# EAGLE design buck_regulator (EAGLE 6.2)
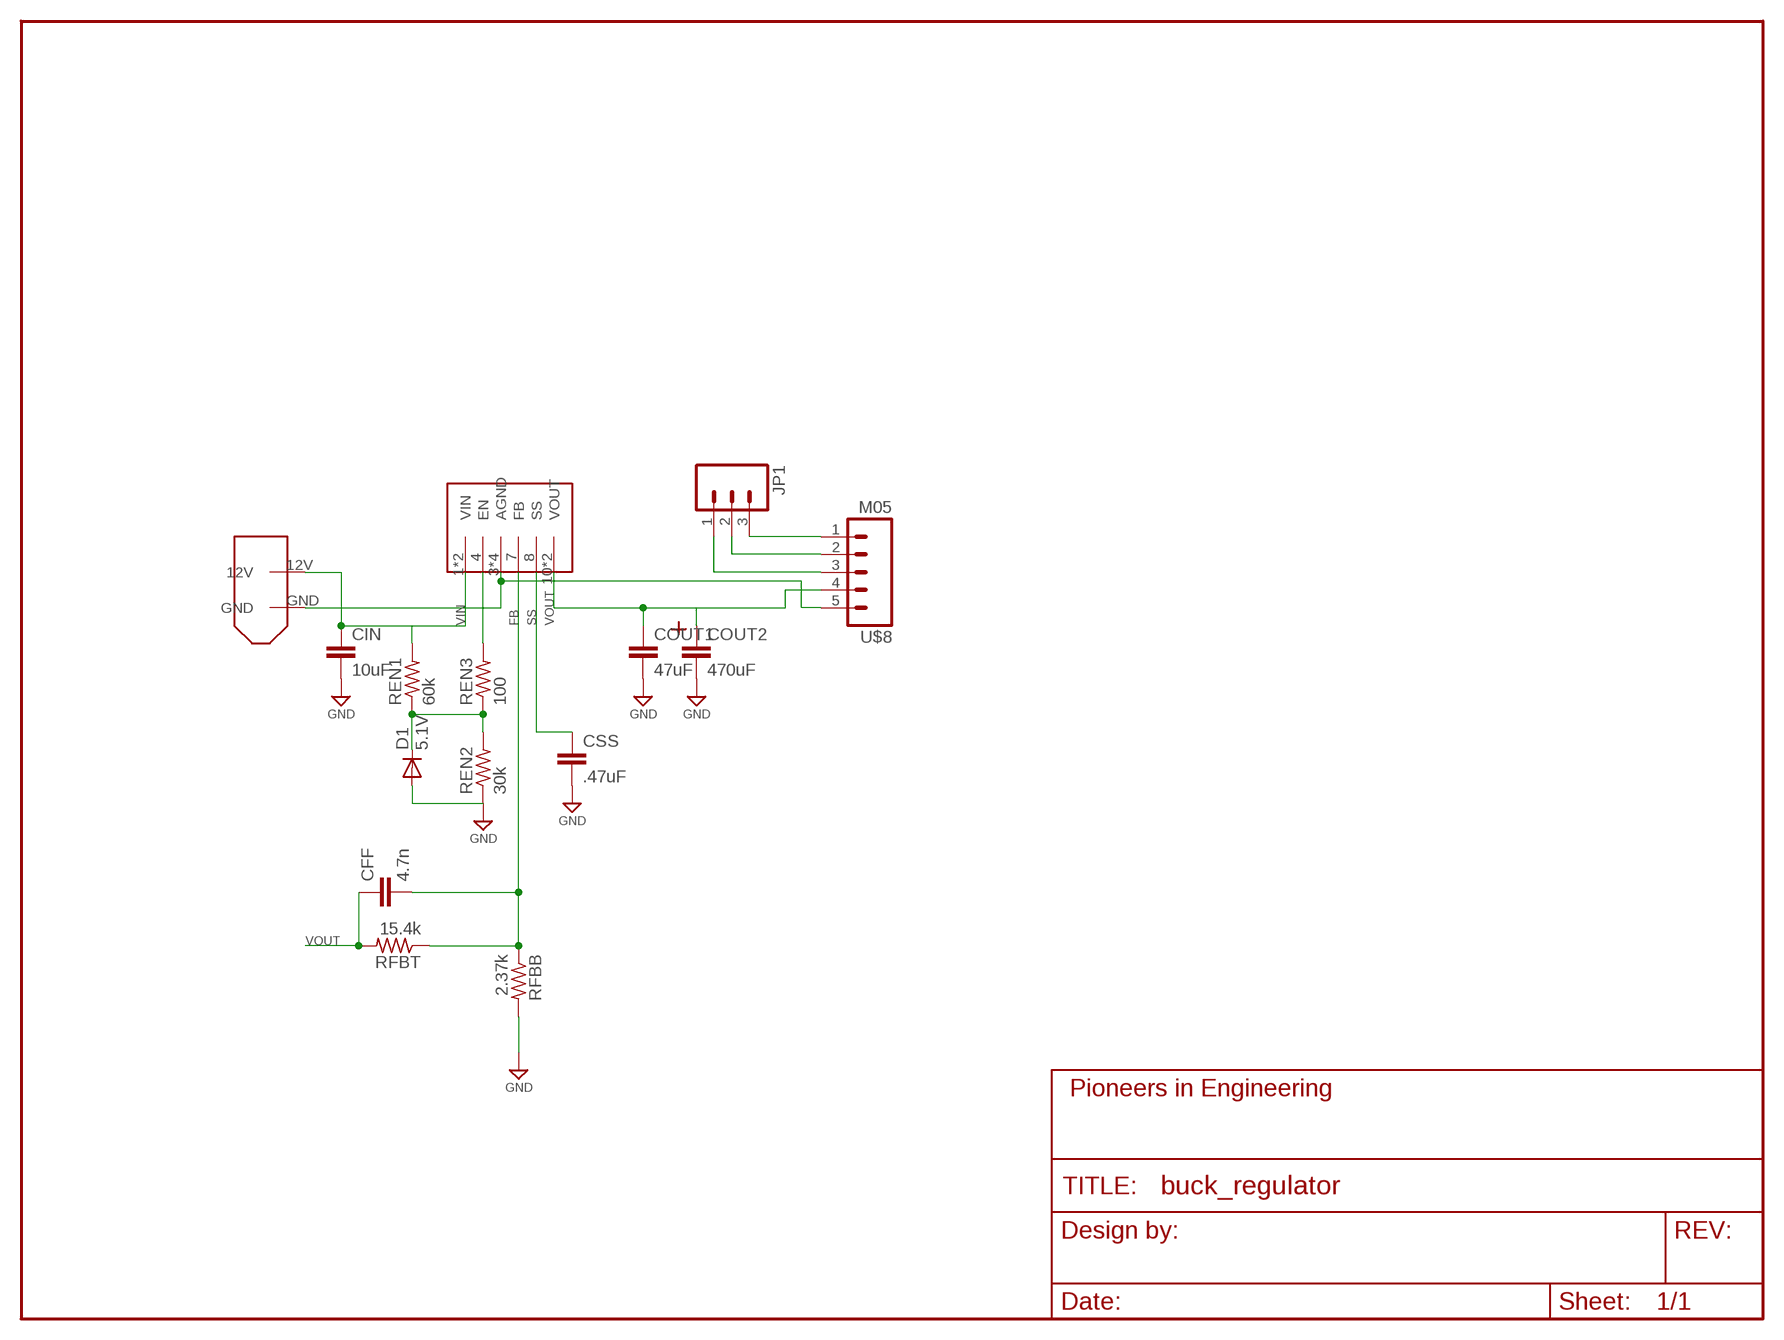
[diagram p0: schematic, sheet 1]
FRAME1 (FRAME-LETTER): AUTHOR: Kate Rakelly; REVISION: B

## Parts
CFF  4.7n  CAP0603-CAP  [0603-CAP]
CIN  10uF  CAP0603-CAP  [0603-CAP]
COUT1  47uF  CAP1206  [1206]
COUT2  470uF  TANT_CASE_E  [TANT_CASE_E]
CSS  .47uF  CAP0603-CAP  [0603-CAP]
D1  5.1V  DIODESOD  [SOD-323]
JP1  M03MTA1X3  [1X03]
REN1  60k  R-US_R0603  [R0603]
REN2  30k  R-US_R0603  [R0603]
REN3  100  R-US_R0603  [R0603]
RFBB  2.37k  R-US_R0603  [R0603]
RFBT  15.4k  R-US_R0603  [R0603]
U$1  LMZ12010  [LMZ12010]
U$2  XT60CONNECTOR  [XT60CONNECTOR]
U$8  M05  [1X05-MTA]

## Nets
FB: CFF.2 RFBB.1 RFBT.1 U$1.7(FB)
GND: CIN.2 COUT1.2 COUT2.NEG CSS.2 D1.2(A) REN2.1 RFBB.2 U$1.3(AGND) U$1.5(AGND) U$1.6(AGND) U$1.GND(AGND) U$2.GND U$8.5
N$1: REN3.2 U$1.4(EN)
N$2: JP1.1 U$8.3
N$3: D1.1(C) REN1.1 REN2.2 REN3.1
N$4: JP1.2 U$8.2
N$5: JP1.3 U$8.1
SS: CSS.1 U$1.8(SS)
VIN: CIN.1 REN1.2 U$1.1(VIN) U$1.2(VIN) U$2.12V
VOUT: CFF.1 COUT1.1 COUT2.POS RFBT.2 U$1.10(VOUT) U$1.11(VOUT) U$8.4

## Library data of the parts
CFF CIN CSS = pie:CAP: Capacitor Standard 0603 ceramic capacitor, and 0.1" leaded capacitor.
COUT1 = SparkFun:CAP: Capacitor Standard 0603 ceramic capacitor, and 0.1" leaded capacitor.
COUT2 = TANT_CASE_E:TANT_CASE_E
D1 = SparkFun:DIODE: Diode These are standard reverse protection diodes and small signal diodes. SMA package can handle up to about 1A. SOD-323 can handle about 200mA. What the SOD-323 package when ordering, there are some mfgs out there that are 5-pin packages.
JP1 = pie:M03: Header 3 Standard 3-pin 0.1" header. Use with straight break away headers (SKU : PRT-00116), right angle break away headers (PRT-00553), swiss pins (PRT-00743), machine pins (PRT-00117), and female headers (PRT-00115). Molex polarized connector foot print use with SKU : PRT-08232 with associated crimp pins and housings.
REN1-REN3 RFBB RFBT = pie:R-US_: RESISTOR, American symbol
U$1 = LMZ12010:LMZ12010
U$2 = pie:XT60CONNECTOR: 12V XT60 power connector
U$8 = pie:M05

## Board
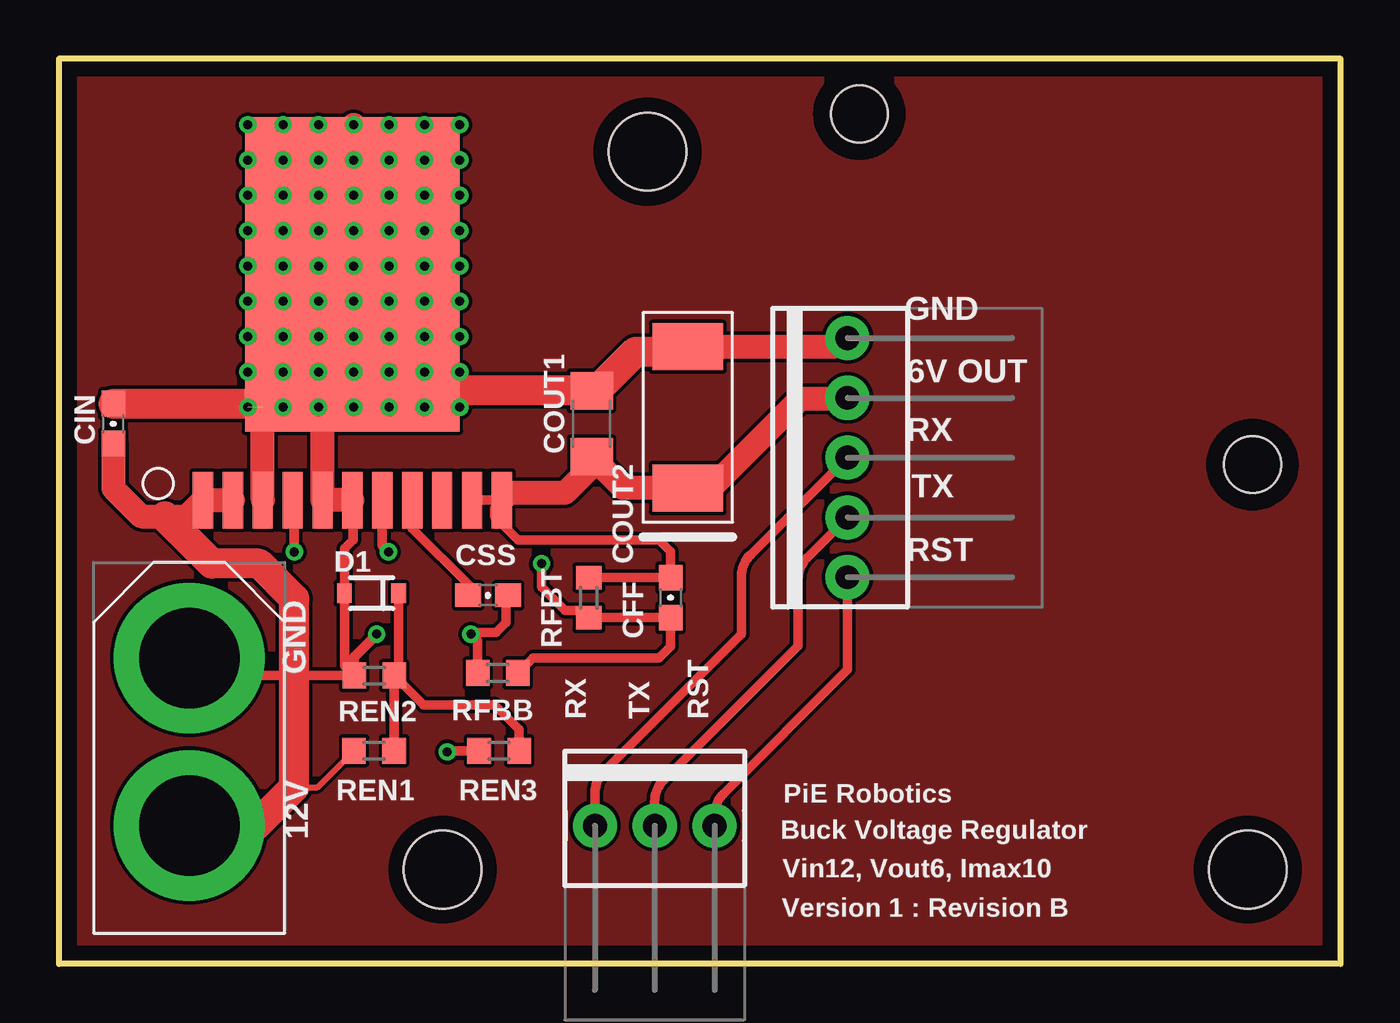
[diagram p1: board, top side]
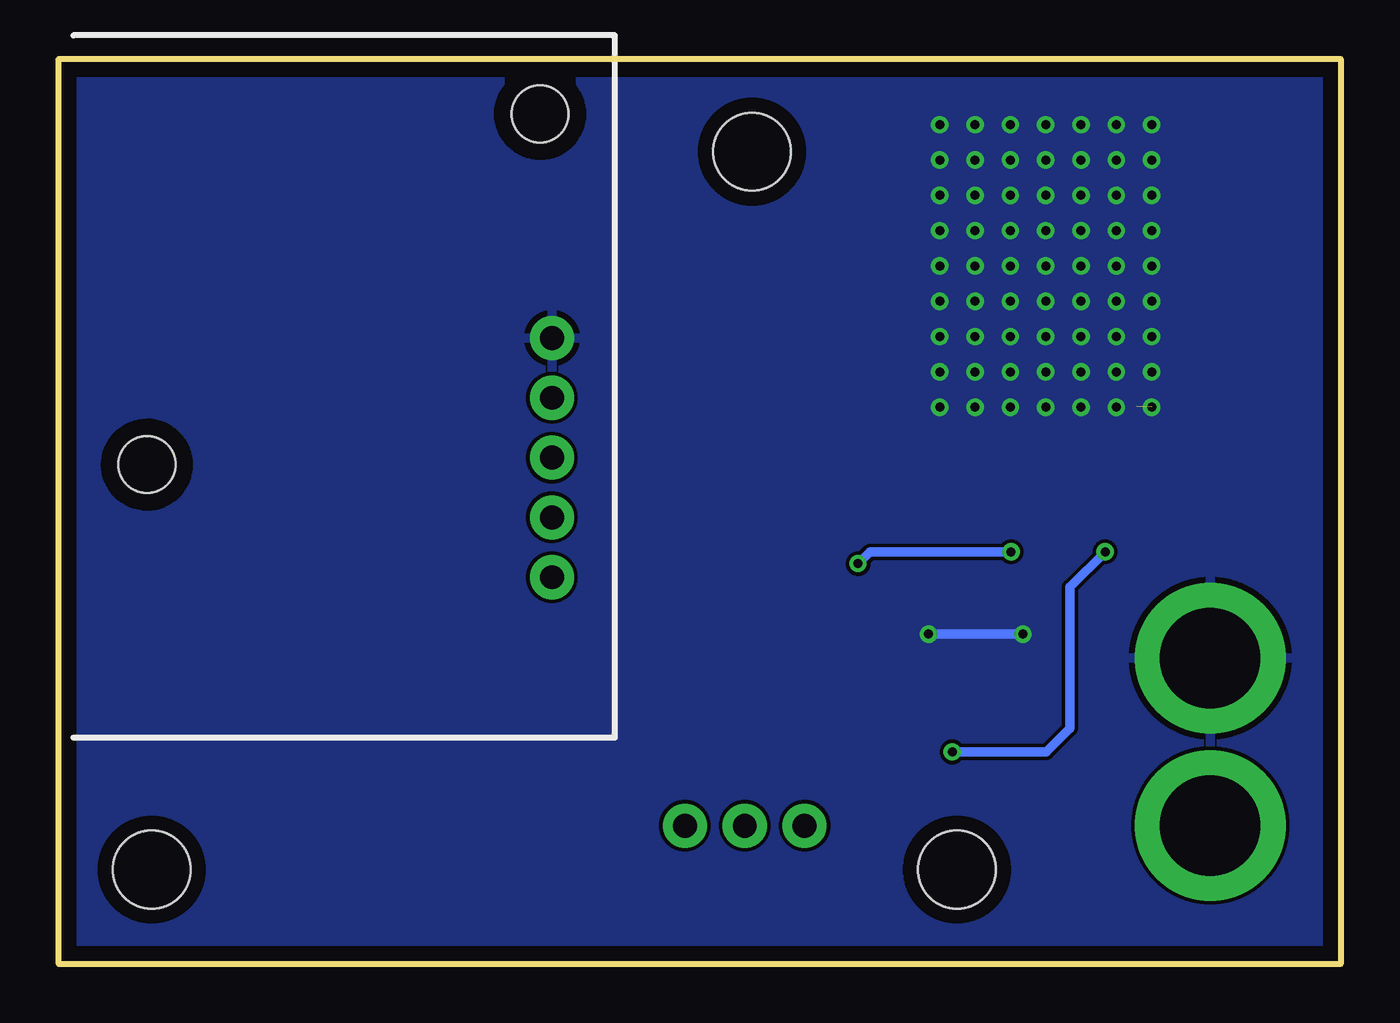
[diagram p2: board, bottom side, seen from below]

Size 54.44 x 38.45 mm. Coordinates in mm from the lower left corner, seen from the top.
Outline: 54.44,0 54.44,38.45 0,38.45 0,0 54.44,0
Copper layers (1*16): Top 2mil / dielectric 9mil / Bottom 2mil
Design rules: minimum track width 6mil, minimum drill 15mil, track to track 6mil, track to pad 10mil, pad to pad 6mil, via to via 6mil, smd to smd 6mil, copper to edge 25mil, drill to drill 7mil, minimum pad ring 7mil, minimum via ring 7mil, stop-mask expansion 3mil, vias tented up to drill 0mil, thermal gap 10mil

### Footprints (pad centres in the part's own frame; a part is rotated, then mirrored left to right if it is on the bottom)
0603-CAP = smd 1.1 x 1: 1 -0.85,0; 2 0.85,0
1206 = smd 1.6 x 1.8: 1 -1.4,0; 2 1.4,0
TANT_CASE_E = smd 2 x 3: NEG 3,0; POS -3,0
SOD-323 = smd 0.63 x 0.83: 1 -1.15,0; 2 1.15,0
1X03 = drill 1.016 pad 1.88: 1 0,0; 2 2.54,0; 3 5.08,0
R0603 = smd 1 x 1.1: 1 -0.85,0; 2 0.85,0
LMZ12010 = smd 0.861 x 2.41: 1 -6.35,-9.601; 2 -5.08,-9.601; 3 -3.81,-9.601; 4 -2.54,-9.601; 5 -1.27,-9.601; 6 0,-9.601; 7 1.27,-9.601; 8 2.54,-9.601; 9 3.81,-9.601; 10 5.08,-9.601; 11 6.35,-9.601 | smd 9.119 x 13.36: GND 0,0
XT60CONNECTOR = drill 4.267: 12V 4.572,4.064; GND 11.684,4.064
STAND-OFF = hole 3.302: 0,0
STAND_OFF_SERVOC = hole 2.41: 0,0
1X05-MTA = drill 1.016 pad 1.88: 1 -5.08,0; 2 -2.54,0; 3 0,0; 4 2.54,0; 5 5.08,0

### Placement (x,y rotation side)
CFF  25.98,15.56 270 top
CIN  2.31,22.95 90 top
COUT1  22.63,22.95 90 top
COUT2  26.71,23.22 90 top
CSS  18.23,15.66 0 top
D1  13.28,15.75 180 top
JP1  22.77,5.87 0 top
REN1  13.39,9.06 180 top
REN2  13.39,12.25 0 top
REN3  18.7,9.06 180 top
RFBB  18.64,12.36 180 top
RFBT  22.51,15.56 90 top
U$1  12.47,29.3 0 top
U$2  9.6,1.31 90 top
U$3  [STAND-OFF]  50.5,4.01 0 top
U$4  [STAND-OFF]  25,34.51 0 top
U$5  [STAND-OFF]  16.3,4.01 0 top
U$6  [STAND_OFF_SERVOC]  50.7,21.21 0 top
U$7  [STAND_OFF_SERVOC]  34,36.11 0 top
U$8  33.5,21.51 90 top

### Tracks (layer width: path | path; a pad name or v marks a point on that pad's centre or on a via)
FB  (via drill 0.38)
  Top 0.406: RFBB.1 20.14,13.01 25.5,13.01 25.98,13.49 CFF.2 RFBT.1 22.21,15.01 21.5,15.01 20.5,16.01 v20.5,17.01 | U$1.7 13.74,17.77 v14,17.51
  Bottom 0.406: v14,17.51 20,17.51 v20.5,17.01
GND  (via drill 0.38, 0.38 pad 0.3)  (1 unrouted)
  Top 0.406: REN2.1 12.13,12.66 D1.2 12.13,17.64 12.5,18.01 12.5,19.67 U$1.6 | REN2.1 6.28,12.25 U$2.GND | REN2.1 12.54,13.01 | 12.54,13.01 12.54,13.05 v13.5,14.01 13.5,13.96 12.54,13.01 | RFBB.2 17.79,13.72 v17.5,14.01 17.5,14.08 18.57,14.08 19,14.51 19,15.58 CSS.2
  Top 1.016: COUT2.NEG 27.5,26.22 32.8,26.22 arc45 33.5,26.51 | U$1.6 U$1.5 11.2,24.31 11,24.51 | U$1.3 8.66,23.67 9.5,24.51 | U$1.GND 12.47,35.52 arc-45 v12.53,35.65
  Top 1.27: 27.5,26.22 27.29,26.01 24.5,26.01 22.84,24.35 COUT1.2 16.23,24.35 v15.53,23.65 | CIN.2 8.79,23.8 9.5,24.51
  Bottom 0.406: v17.5,14.01 v13.5,14.01
  other vias: 8.03,35.65 8.03,35.65 9.53,35.65 11.03,35.65 14.03,35.65 14.03,35.65 14.03,35.65 15.53,35.65 17.02,35.65 8.03,34.15 8.03,34.15 9.53,34.15 11.03,34.15 14.03,34.15 14.03,34.15 14.03,34.15 15.53,34.15 17.02,34.15 12.53,34.15 8.03,32.65 8.03,32.65 9.53,32.65 11.03,32.65 14.03,32.65 14.03,32.65 14.03,32.65 15.53,32.65 17.02,32.65 12.53,32.65 8.03,31.15 8.03,31.15 9.53,31.15 11.03,31.15 14.03,31.15 14.03,31.15 14.03,31.15 15.53,31.15 17.02,31.15 12.53,31.15 8.03,29.65 8.03,29.65 9.53,29.65 11.03,29.65 14.03,29.65 14.03,29.65 14.03,29.65 15.53,29.65 17.02,29.65 12.53,29.65 8.03,28.15 8.03,28.15 9.53,28.15 11.03,28.15 14.03,28.15 14.03,28.15 14.03,28.15 15.53,28.15 17.02,28.15 12.53,28.15 8.03,26.65 8.03,26.65 9.53,26.65 11.03,26.65 14.03,26.65 14.03,26.65 14.03,26.65 15.53,26.65 17.02,26.65 12.53,26.65 8.03,25.15 8.03,25.15 9.53,25.15 11.03,25.15 14.03,25.15 14.03,25.15 14.03,25.15 15.53,25.15 17.02,25.15 12.53,25.15 9.53,23.65 11.03,23.65 14.03,23.65 14.03,23.65 14.03,23.65 17.02,23.65 12.53,23.65 8.03,23.65
  pour Bottom: 0.5,38.01 54.5,38.01 54.5,0.51 0.5,0.51
N$1  (via drill 0.38)
  Top 0.406: REN3.2 16.55,9.06 v16.5,9.01 | v10,17.51 10,19.63 U$1.4
  Bottom 0.406: v16.5,9.01 12.5,9.01 11.5,10.01 11.5,16.01 v10,17.51
N$2
  Top 0.406: JP1.1 22.77,7.25 arc-45 23.14,8.15 29,14.01 29,16.48 arc-45 29.37,17.38 U$8.3
N$3
  Top 0.406: REN1.1 REN2.2 | D1.1 14.43,12.44 REN2.2 | REN3.1 19.55,9.96 18.5,11.01 15.48,11.01 REN2.2
N$4
  Top 0.406: JP1.2 25.31,6.89 arc-45 25.68,7.79 31.4,13.51 31.4,16.34 arc-45 31.77,17.24 U$8.2
N$5
  Top 0.406: JP1.3 27.85,6.33 arc-45 28.22,7.23 33.5,12.51 U$8.1
N$21
  pour Top: 0.5,38.01 54.5,38.01 54.5,0.51 0.5,0.51
SS
  Top 0.406: U$1.8 15.01,18.5 17.5,16.01 17.5,15.78 CSS.1
VIN
  Top 0.254: 10,7.51 10.99,7.51 REN1.2
  Top 1.016: CIN.1 2.31,20.2 3.5,19.01 4.5,19.01 5.43,19.01 U$1.1 U$1.2
  Top 1.27: U$2.12V 8.37,5.88 10,7.51 10,15.51 8.5,17.01 6.5,17.01 4.5,19.01
VOUT
  Top 0.406: U$1.10 U$1.11 18.5,19.38 18.5,19.01 19.5,18.01 25.5,18.01 25.98,17.52 CFF.1 RFBT.2
  Top 1.016: U$1.11 19.13,20.01 21.5,20.01 22.63,21.14 COUT1.1 23.96,20.22 COUT2.POS 27.71,20.22 31.5,24.01 33.4,24.01 arc45 U$8.4

### Text on the board
tNames: GND | 6V OUT | RX | TX | RST | GND | RX | TX | RST | PiE Robotics | 12V | Buck Voltage Regulator | Vin12, Vout6, Imax10 | Version 1 : Revision B